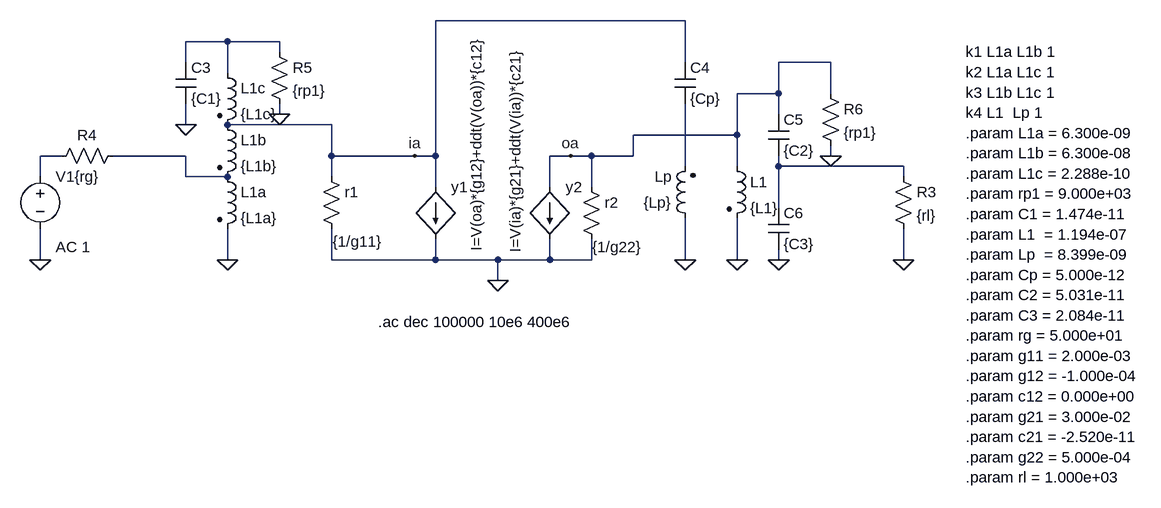
[diagram p0: schematic QuintaRFruido.asc]
QuintaRFruido.asc, the LTspice schematic file:
Version 4
SHEET 1 880 680
WIRE 64 -592 -320 -592
WIRE -640 -560 -704 -560
WIRE -560 -560 -640 -560
WIRE -560 -544 -560 -560
WIRE -704 -528 -704 -560
WIRE 64 -528 64 -592
WIRE 288 -528 208 -528
WIRE -640 -512 -640 -560
WIRE 208 -480 208 -528
WIRE 208 -480 144 -480
WIRE 288 -480 288 -528
WIRE -560 -448 -560 -464
WIRE 208 -448 208 -480
WIRE -704 -432 -704 -464
WIRE -480 -432 -640 -432
WIRE 144 -416 144 -480
WIRE 144 -416 -16 -416
WIRE -896 -384 -928 -384
WIRE -704 -384 -816 -384
WIRE -480 -384 -480 -432
WIRE -352 -384 -480 -384
WIRE -320 -384 -320 -592
WIRE -320 -384 -352 -384
WIRE -112 -384 -144 -384
WIRE -80 -384 -112 -384
WIRE -16 -384 -16 -416
WIRE -16 -384 -80 -384
WIRE 288 -384 288 -400
WIRE 64 -368 64 -464
WIRE 144 -368 144 -416
WIRE 208 -368 208 -384
WIRE 400 -368 208 -368
WIRE -928 -352 -928 -384
WIRE -704 -352 -704 -384
WIRE -640 -352 -704 -352
WIRE -480 -352 -480 -384
WIRE 400 -352 400 -368
WIRE -320 -336 -320 -384
WIRE -144 -336 -144 -384
WIRE -80 -336 -80 -384
WIRE 208 -304 208 -368
WIRE -928 -224 -928 -272
WIRE -640 -224 -640 -272
WIRE -480 -224 -480 -272
WIRE -320 -224 -320 -256
WIRE -320 -224 -480 -224
WIRE -224 -224 -320 -224
WIRE -144 -224 -144 -256
WIRE -144 -224 -224 -224
WIRE -80 -224 -80 -256
WIRE -80 -224 -144 -224
WIRE 64 -224 64 -288
WIRE 144 -224 144 -288
WIRE 208 -224 208 -240
WIRE 400 -224 400 -272
WIRE -224 -192 -224 -224
FLAG -928 -224 0
FLAG -352 -384 ia
FLAG -112 -384 oa
FLAG -224 -192 0
FLAG 400 -224 0
FLAG -640 -224 0
FLAG -704 -432 0
FLAG 64 -224 0
FLAG 144 -224 0
FLAG 208 -224 0
FLAG -560 -448 0
FLAG 288 -384 0
SYMBOL res -496 -368 R0
WINDOW 3 18 116 Left 2
SYMATTR Value {1/g11}
SYMATTR InstName r1
SYMBOL res -96 -352 R0
WINDOW 3 17 108 Left 2
SYMATTR Value {1/g22}
SYMATTR InstName r2
SYMBOL bi -320 -336 R0
WINDOW 3 63 99 VLeft 2
SYMATTR Value I=V(oa)*{g12}+ddt(V(oa))*{c12}
SYMATTR InstName y1
SYMBOL bi -144 -336 R0
WINDOW 3 -53 101 VLeft 2
SYMATTR Value I=V(ia)*{g21}+ddt(V(ia))*{c21}
SYMATTR InstName y2
SYMBOL voltage -928 -368 R0
WINDOW 123 24 124 Left 2
WINDOW 39 0 0 Left 2
SYMATTR Value2 AC 1
SYMATTR InstName V1
SYMATTR Value ""
SYMBOL res 384 -368 R0
SYMATTR InstName R3
SYMATTR Value {rl}
SYMBOL res -800 -400 R90
WINDOW 0 0 56 VBottom 2
WINDOW 3 32 56 VTop 2
SYMATTR InstName R4
SYMATTR Value {rg}
SYMBOL ind2 -656 -368 R0
SYMATTR InstName L1a
SYMATTR Value {L1a}
SYMATTR Type ind
SYMBOL cap -720 -528 R0
SYMATTR InstName C3
SYMATTR Value {C1}
SYMBOL ind2 -656 -448 R0
SYMATTR InstName L1b
SYMATTR Value {L1b}
SYMATTR Type ind
SYMBOL ind2 -656 -528 R0
SYMATTR InstName L1c
SYMATTR Value {L1c}
SYMATTR Type ind
SYMBOL ind2 80 -272 R180
WINDOW 0 36 80 Left 2
WINDOW 3 36 40 Left 2
SYMATTR InstName Lp
SYMATTR Value {Lp}
SYMATTR Type ind
SYMBOL ind2 128 -384 R0
SYMATTR InstName L1
SYMATTR Value {L1}
SYMATTR Type ind
SYMBOL cap 48 -528 R0
SYMATTR InstName C4
SYMATTR Value {Cp}
SYMBOL cap 192 -448 R0
SYMATTR InstName C5
SYMATTR Value {C2}
SYMBOL cap 192 -304 R0
SYMATTR InstName C6
SYMATTR Value {C3}
SYMBOL res -576 -560 R0
SYMATTR InstName R5
SYMATTR Value {rp1}
SYMBOL res 272 -496 R0
SYMATTR InstName R6
SYMATTR Value {rp1}
TEXT -408 -128 Left 2 !.ac dec 100000 10e6 400e6
TEXT 496 -544 Left 2 !k1 L1a L1b 1\nk2 L1a L1c 1\nk3 L1b L1c 1\nk4 L1  Lp 1\n.param L1a = 6.300e-09\n.param L1b = 6.300e-08\n.param L1c = 2.288e-10\n.param rp1 = 9.000e+03\n.param C1 = 1.474e-11\n.param L1  = 1.194e-07\n.param Lp  = 8.399e-09\n.param Cp = 5.000e-12\n.param C2 = 5.031e-11\n.param C3 = 2.084e-11\n.param rg = 5.000e+01\n.param g11 = 2.000e-03\n.param g12 = -1.000e-04\n.param c12 = 0.000e+00\n.param g21 = 3.000e-02\n.param c21 = -2.520e-11\n.param g22 = 5.000e-04\n.param rl = 1.000e+03

The netlist it stands for:
* QuintaRFruido.asc
r1 ia 0 {1/g11}
r2 oa 0 {1/g22}
B§y1 ia 0 I=V(oa)*{g12}+ddt(V(oa))*{c12}
B§y2 oa 0 I=V(ia)*{g21}+ddt(V(ia))*{c21}
V1 N002 0 AC 1
R3 N005 0 {rl}
R4 N003 N002 {rg}
L1a N003 0 {L1a}
C3 N001 0 {C1}
L1b ia N003 {L1b}
L1c N001 ia {L1c}
Lp 0 N004 {Lp}
L1 oa 0 {L1}
C4 ia N004 {Cp}
C5 oa N005 {C2}
C6 N005 0 {C3}
R5 N001 0 {rp1}
R6 oa 0 {rp1}
.ac dec 100000 10e6 400e6
k1 L1a L1b 1
k2 L1a L1c 1
k3 L1b L1c 1
k4 L1  Lp 1
.param L1a = 6.300e-09
.param L1b = 6.300e-08
.param L1c = 2.288e-10
.param rp1 = 9.000e+03
.param C1 = 1.474e-11
.param L1  = 1.194e-07
.param Lp  = 8.399e-09
.param Cp = 5.000e-12
.param C2 = 5.031e-11
.param C3 = 2.084e-11
.param rg = 5.000e+01
.param g11 = 2.000e-03
.param g12 = -1.000e-04
.param c12 = 0.000e+00
.param g21 = 3.000e-02
.param c21 = -2.520e-11
.param g22 = 5.000e-04
.param rl = 1.000e+03
.backanno
.end